# Altium project mach khoa so dien tu.PrjPcb
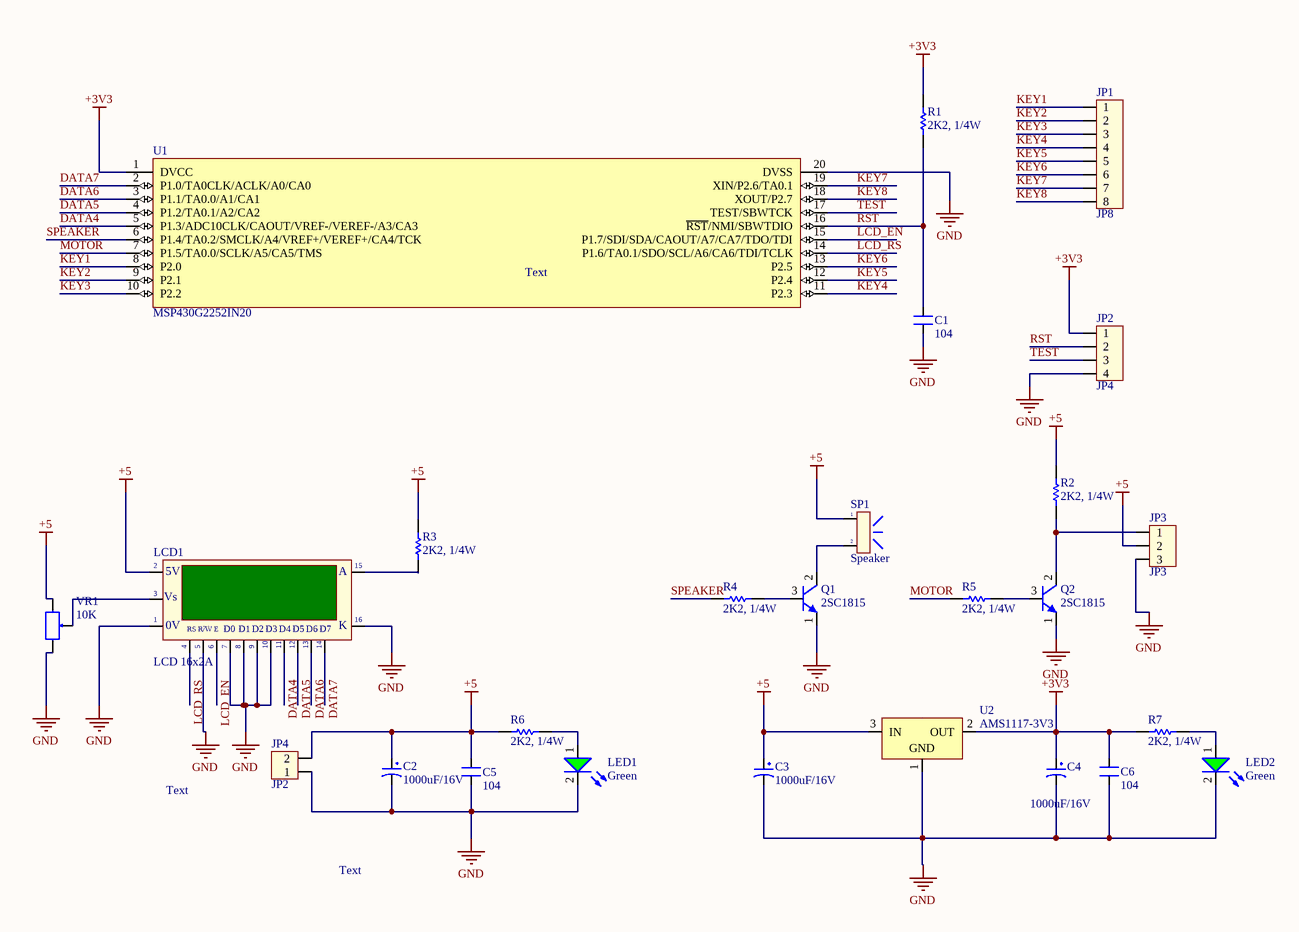
[diagram p0: Sheet2.SchDoc]
1 sheet, 26 parts. Net scope: global (net labels, ports and power ports of the same name join across sheets).
Board file: PCB1.PcbDoc

## Sheet Sheet2.SchDoc
size A3; SheetNumber: 1; SheetTotal: 1

### Parts
C1  104  [CN2]
C2  1000uF/16V  [CP1.5/3.4]
C3  1000uF/16V  [CP1.5/3.4]
C4  1000uF/16V  [CP1.5/3.4]
C5  104  [CN2]
C6  104  [CN2]
JP1  JP8  [CON8]
JP2  JP4  [CON4]
JP3  JP3  [CON3]
JP4  JP2  [CON2]
LCD1  LCD 16x2A  [LCD16x2]
LED1  value Green  [LED3G]  (hidden comment: LED_G_3)
LED2  value Green  [LED3G]  (hidden comment: LED_G_3)
Q1  2SC1815  [2SC1815]
Q2  2SC1815  [2SC1815]
R1  value 2K2, 1/4W  [RES 1/4W CFR25]  (hidden comment: CF1/4W2K2J25)
R2  value 2K2, 1/4W  [RES 1/4W CFR25]  (hidden comment: CF1/4W2K2J25)
R3  value 2K2, 1/4W  [RES 1/4W CFR25]  (hidden comment: CF1/4W2K2J25)
R4  value 2K2, 1/4W  [RES 1/4W CFR25]  (hidden comment: CF1/4W2K2J25)
R5  value 2K2, 1/4W  [RES 1/4W CFR25]  (hidden comment: CF1/4W2K2J25)
R6  value 2K2, 1/4W  [RES 1/4W CFR25]  (hidden comment: CF1/4W2K2J25)
R7  value 2K2, 1/4W  [RES 1/4W CFR25]  (hidden comment: CF1/4W2K2J25)
SP1  Speaker  [SPK]
U1  MSP430G2252IN20  [MSP430G2552]
U2  AMS1117-3V3  [AMS1117-3.3V]
VR1  10K  [VR1]

### Nets
+3V3: C4.1 C6.2 JP2.1 R1.2 R7.2 U1.1(DVCC) U2.2(OUT)
+5: C2.1 C3.1 C5.2 JP3.2 JP4.2 LCD1.2(VDD) R2.1 R3.2 R6.2 SP1.1 U2.3(IN) VR1.1
GND: C1.1 C2.2 C3.2 C4.2 C5.1 C6.1 JP2.4 JP3.3 JP4.1 LCD1.1(GND) LCD1.5(R/~{W}) LCD1.7(D0) LCD1.8(D1) LCD1.9(D2) LCD1.10(D3) LCD1.16(K) LED1.2(K) LED2.2(K) Q1.1(E) Q2.1(E) U1.20(DVSS) U2.1(GND) VR1.3
DATA4: LCD1.11(D4) U1.5(P1.3/ADC10CLK/CAOUT/VREF-/VEREF-/A3/CA3)
DATA5: LCD1.12(D5) U1.4(P1.2/TA0.1/A2/CA2)
DATA6: LCD1.13(D6) U1.3(P1.1/TA0.0/A1/CA1)
DATA7: LCD1.14(D7) U1.2(P1.0/TA0CLK/ACLK/A0/CA0)
KEY1: JP1.1 U1.8(P2.0)
KEY2: JP1.2 U1.9(P2.1)
KEY3: JP1.3 U1.10(P2.2)
KEY4: JP1.4 U1.11(P2.3)
KEY5: JP1.5 U1.12(P2.4)
KEY6: JP1.6 U1.13(P2.5)
KEY7: JP1.7 U1.19(XIN/P2.6/TA0.1)
KEY8: JP1.8 U1.18(XOUT/P2.7)
LCD_EN: LCD1.6(~{EN}) U1.15(P1.7/SDI/SDA/CAOUT/A7/CA7/TDO/TDI)
LCD_RS: LCD1.4(RS) U1.14(P1.6/TA0.1/SDO/SCL/A6/CA6/TDI/TCLK)
MOTOR: R5.2 U1.7(P1.5/TA0.0/SCLK/A5/CA5/TMS)
RST: C1.2 JP2.2 R1.1 U1.16(~{RST}/NMI/SBWTDIO)
SPEAKER: R4.2 U1.6(P1.4/TA0.2/SMCLK/A4/VREF+/VEREF+/CA4/TCK)
TEST: JP2.3 U1.17(TEST/SBWTCK)
NetJP3_1: JP3.1 Q2.2(C) R2.2
NetLCD1_3: LCD1.3(VEE) VR1.2
NetLCD1_15: LCD1.15(A) R3.1
NetLED1_1: LED1.1(A) R6.1
NetLED2_1: LED2.1(A) R7.1
NetQ1_2: Q1.2(C) SP1.2
NetQ1_3: Q1.3(B) R4.1
NetQ2_3: Q2.3(B) R5.1

Not connected (* = marked no-connect by the designer): U2 4(OUT)

### Notes on the sheet
- (near U1) Text
- Text
- (in symbol LCD16x2A) 5V; Vs; |; 0V; R/W; E

### Library data of the parts
C1 C5 C6 = CN2: Cap np 104 => 105pF; Value: 0.1uF
C2-C4 = CP4: Cap 1000uF/16V - 220uF/50V; Description 5: 4,7uF>10uF/250V_3,3uF>10uF/400V - 2,2uF>4,7uF/450V; Description 1: 2200uF-3300uF/6,3V - 1000uF-2200uF/10V; Description 2: 1000uF/16V - 470uF => 1000uF/25V - 100uF/100V; Description 3: 330uF>470uF/35V_220uF>470uF/50V_10uF>22uF/250V; Description 4: 220uF => 330uF/63V - 10uF =>33uF/160 - 200V; Value: 1000uF/16V
JP1 = Con8: Connector 8; Value: Connector 8
JP2 = Con4: Connector 4; Value: Connector 4
JP3 = Con3: Connector 3; Value: Connector 3
JP4 = Con2: Connector 2; Value: Connector 2
LCD1 = LCD16x2A: LCD dipslay 16 char, 2 line; Value: LCD16x2A
LED1 LED2 = LED_GREEN_3MM: LED Green 3mm; ComponentLink1Description: Datasheet; ComponentLink1URL: D:\Dropbox\Datasheets\Opto and Illumination\LEDs\SMD LED.pdf; Unit Price: 0.0476
Q1 Q2 = 2SC1815: Trans NPN 50V 150mA TO-92; ComponentLink1Description: Datasheet; ComponentLink1URL: D:\Dropbox\Datasheets\Transistors\P Channel Bipolar\2SC1815.pdf; Unit Price: 0.0143
R1-R7 = CF1/4W2K2J25: RES CF AXIAL-0.3 5% 1/4W 2K2; Unit Price: 0.001; ComponentLink1Description: Datasheet; ComponentLink1URL: D:\Dropbox\Datasheets\Passive Components\Resistors\Carbon Film Resistor.pdf
SP1 = SPK: Speaker Chip; Value: Speaker Chip
U1 = MSP430G2252IN20: MCU 16bit 16KB 1.8-3.6V 16MHz DIP20; ComponentLink1Description: Datasheet; ComponentLink1URL: D:\Dropbox\Datasheets\Microcontrolers\MSP430\MSP430x2xx Family\MSP430G2553.pdf; Unit Price: 1.0000
U2 = AMS1117-3V3: Linear Voltage Regulator 3.3V 1A 15V Max SOT-223; ComponentLink1Description: Datasheet; ComponentLink1URL: D:\Dropbox\Datasheets\Power Management ICs\Linear Regulators\AMS1117.pdf; Unit Price: 0.2000
VR1 = VR: Var Resistor; Value: VR 10K